# Altium project Temperature Sensor.PrjPcb (part 2 of 2)

## Sheet EEPROM and Temperature Sensor.SchDoc
size A4
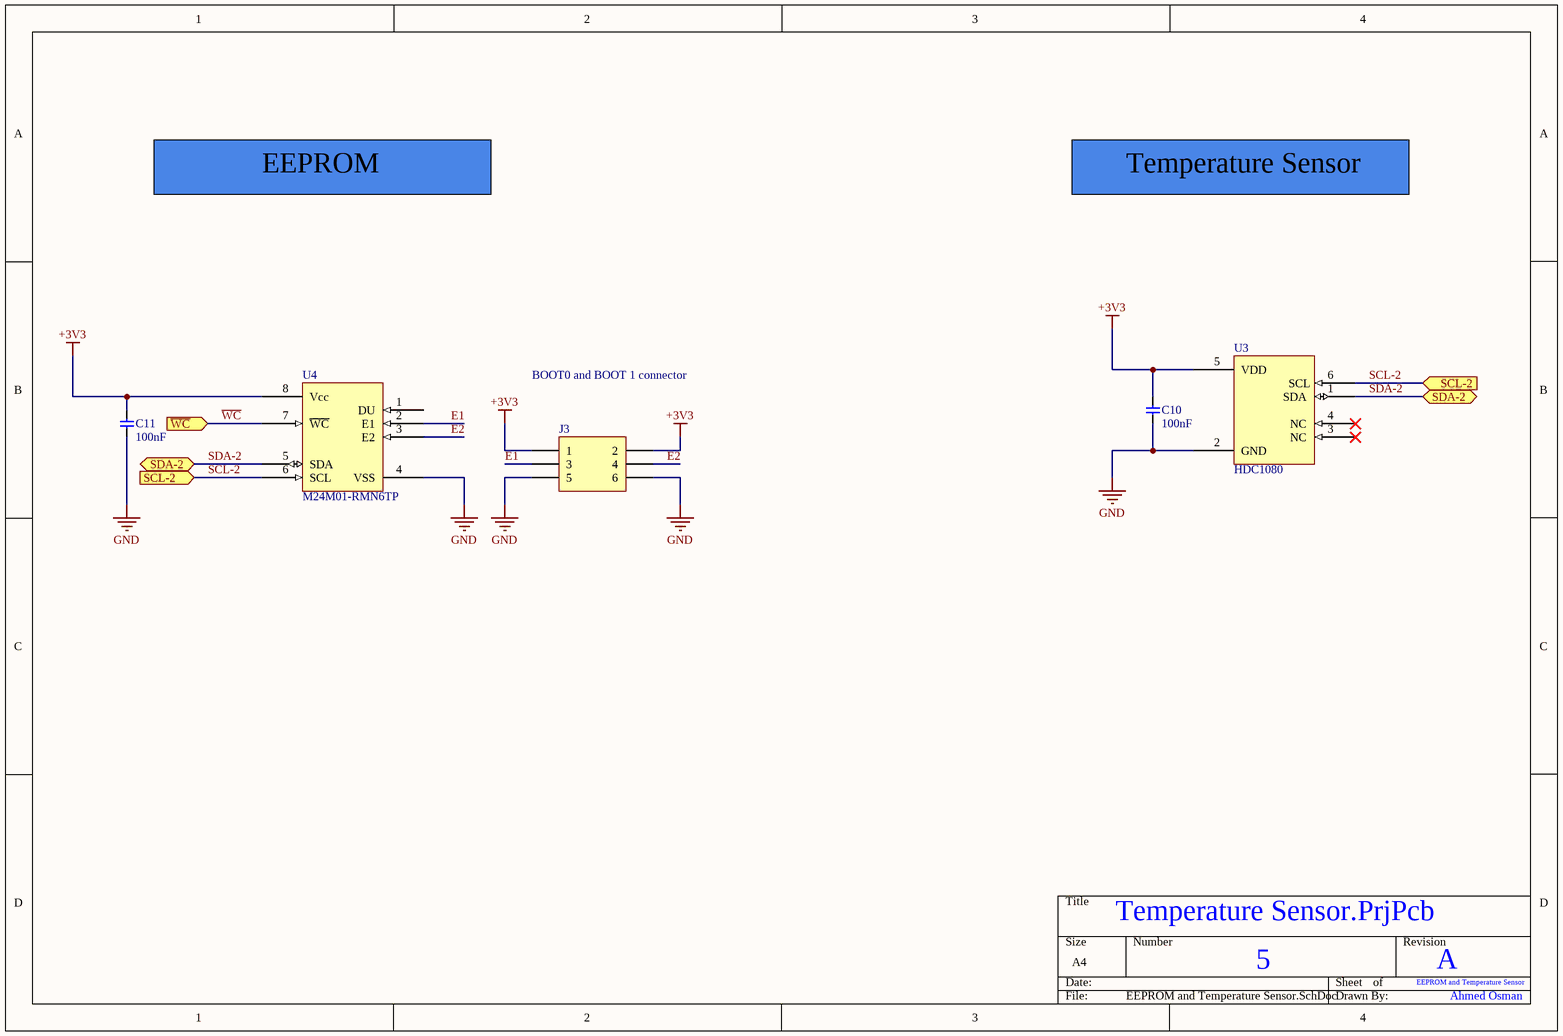
[diagram p4: EEPROM and Temperature Sensor.SchDoc]

### Parts
C10  100nF  [CAP 0603]
C11  100nF  [CAP 0603]
J3  BOOT0 and BOOT 1 connector  [2X3 Female Pin Header Connector]
U3  HDC1080  [PWSON(6-pin) DMB]
U4  M24M01-RMN6TP  [SO8N]

### Ports
SCL-2 (in), SDA-2 (bidir), ~{WC} (in)

### Nets
+3V3: C10.2 C11.1 J3.1 J3.2 U3.5(VDD) U4.8(Vcc)
GND: C10.1 C11.2 J3.5 J3.6 U3.2(GND) U4.4(VSS)
E1: J3.3 U4.2(E1)
E2: J3.4 U4.3(E2)
SCL-2: U3.6(SCL) U4.6(SCL) ; port SCL-2
SDA-2: U3.1(SDA) U4.5(SDA) ; port SDA-2
~{WC}: U4.7(~{WC}) ; port ~{WC}

Not connected (* = marked no-connect by the designer): U3 3(NC)* 4(NC)*; U4 1(DU)

### Notes on the sheet
- EEPROM
- Temperature Sensor
- 5
- EEPROM and Temperature Sensor
- A
- Ahmed Osman

### Library data of the parts
C10 C11 = CAP  0603 100nF 10% 50 V: 0.1 µF ±10% 50V Ceramic Capacitor X7R 0603 (1608 Metric); Manufacturer 1: Samsung; Manufacturer Part Number 1: CL10B104KB8NNNC; Supplier 1: Digikey; Stock 1: 6418947; Pricing 1: 4000 = 0.00562, 8000 = 0.00513, 12000 = 0.00489, 28000 = 0.00464, 100000 = 0.00336, 200000 = 0.00325, 400000 = 0.00306 (USD); RoHS: Yes; Mount: Surface Mount; Case/Package: 0603; Case Code (Metric): 1608; Case Code (Imperial): 0603; Material: Ceramic; Min Operating Temperature: -55°C; Max Operating Temperature: 125°C; Capacitance: 100nF; Tolerance: 10%; Dielectric: X7R; Voltage: 50V; Voltage Rating (DC): 50V; Voltage Rating: 50V; Package Quantity: 1; Packaging: Tape and Reel; Series: CL; Construction: Flat; Length: 1.6mm; Width: 0.031inch; Height: 0.8mm; Depth: 0.8mm; Thickness: 0.035inch; Radiation Hardening: No; Lead Free: Lead Free; RoHS Compliant: Yes; ComponentLink1URL: https://datasheet.ciiva.com/25803/cl10b104kb8nnnc-25803393.pdf?src-supplier=Digikey; ComponentLink1Description: https://datasheet.ciiva.com/25803/cl10b104kb8nnnc-25803393.pdf?src-supplier=Digikey; ComponentLink2URL: https://datasheet.ciiva.com/26838/getdatasheetpartid-89097-26838411.pdf?src-supplier=Verical; ComponentLink2Description: https://datasheet.ciiva.com/26838/getdatasheetpartid-89097-26838411.pdf?src-supplier=Verical; ComponentLink3URL: https://datasheet.ciiva.com/29198/456651-da-01-en-vs-kondensator-0605-29198839.pdf?src-supplier=Conrad; ComponentLink3Description: https://datasheet.ciiva.com/29198/456651-da-01-en-vs-kondensator-0605-29198839.pdf?src-supplier=Conrad; Supplier Part Number 1: 1276-1000-2-ND; value: 100nF; Manufacturer 2: Samsung; Manufacturer Part Number 2: CL10B104KB8NNNC; Supplier 2: LCSC; Supplier Part Number 2: C1591
J3 = BOOT0 and BOOT 1 connector: 2.54mm 2.54mm Double Row 2.5A 6P -40℃~+105℃ Direct Insert 2x3P Top 8.5mm Square Hole Plugin,P=2.54mm Female Headers ROHS; Supplier 2: LCSC; Supplier Part Number 2: C5116527; Manufacturer 2: ZHOURI; Manufacturer Part Number 2: PM2.54-2*3
U3 = HDC1080: Humidity, Temperature 0 ~ 100% RH I2C ±2% RH 15 s Surface Mount; Response Time: 15s; Supplier 1: Digikey; Stock 1: 6270; Pricing 1: 1 = 3.47, 5 = 2.928, 10 = 2.721, 25 = 2.4688, 50 = 2.2942, 100 = 2.1319, 500 = 1.79838, 1000 = 1.67143 (USD); RoHS: Yes; Mount: Surface Mount; Min Operating Temperature: -40°C; Max Operating Temperature: 125°C; Accuracy: 2%; Interface: I2C; Sensor Type: Temperature; Output Type: I2C; Series: -; Packaging: Cut Tape; Lead Free: Lead Free; RoHS Compliant: Yes; ComponentLink1URL: http://www.ti.com/lit/ds/symlink/hdc1080.pdf?src-supplier=Digikey; ComponentLink1Description: http://www.ti.com/lit/ds/symlink/hdc1080.pdf?src-supplier=Digikey; ComponentLink2URL: http://www.ti.com/general/docs/suppproductinfo.tsp?distId=10&amp;gotoUrl=http%3A%2F%2Fwww.ti.com%2Flit%2Fgpn%2Fhdc1080&src-supplier=Digikey; ComponentLink2Description: http://www.ti.com/general/docs/suppproductinfo.tsp?distId=10&amp;gotoUrl=http%3A%2F%2Fwww.ti.com%2Flit%2Fgpn%2Fhdc1080&src-supplier=Digikey; Supplier 2: LCSC; Supplier Part Number 2: C82227; Supplier Part Number 1: 296-46272-1-ND; Manufacturer 2: Texas Instruments; Manufacturer Part Number 2: HDC1080DMBR
U4 = M24M01-RMN6TP: EEPROM Memory IC 1Mbit I2C 1 MHz 500 ns 8-SOIC; Organization: 32KX8; Interface: I2C,Serial; Access Time: 500ns; Density: 1Mb; Max Frequency: 400kHz; Max Supply Voltage: 5.5V; Min Supply Voltage: 1.8V; Frequency: 1MHz; Operating Supply Voltage: 5V; Memory Type: Non-Volatile,EEPROM; Write Cycle Time-Max (tWC): 5ms; Access Time-Max: 900ns; Write Protection: YES; Supply Current: 2mA; Supplier 1: Digikey; Stock 1: 11953; Pricing 1: 1 = 1.41, 10 = 1.287, 25 = 1.252, 50 = 1.2456, 100 = 1.1134, 250 = 1.11012, 500 = 1.09336, 1000 = 1.04695 (USD); RoHS: Yes; Mount: Surface Mount; Case/Package: SOIC; Number of Pins: 8; Min Operating Temperature: -40°C; Max Operating Temperature: 85°C; Packaging: Tape and Reel; Package Quantity: 2500; Memory Size: 1Mb; Series: -; Supply Voltage-Nom: 5.5V; Programming Voltage: 5.5V; Length: 5mm; Width: 4mm; Height: 1.25mm; Radiation Hardening: No; Lead Free: Lead Free; RoHS Compliant: Yes; ComponentLink1URL: https://datasheet.ciiva.com/1905/cd00147128-1905279.pdf?src-supplier=Digikey; ComponentLink1Description: https://datasheet.ciiva.com/1905/cd00147128-1905279.pdf?src-supplier=Digikey; ComponentLink2URL: https://datasheet.ciiva.com/1905/cd00147128-1905280.pdf?src-supplier=Digikey; ComponentLink2Description: https://datasheet.ciiva.com/1905/cd00147128-1905280.pdf?src-supplier=Digikey; ComponentLink3URL: https://datasheet.ciiva.com/1905/cd00147128-1905281.pdf?src-supplier=Digikey; ComponentLink3Description: https://datasheet.ciiva.com/1905/cd00147128-1905281.pdf?src-supplier=Digikey; ComponentLink4URL: https://datasheet.ciiva.com/41455/001185587-da-01-en-ic-eeprom-1mbit-m24m01-rmn6tp-soic-8-stm-41455205.pdf?src-supplier=Conrad; ComponentLink4Description: https://datasheet.ciiva.com/41455/001185587-da-01-en-ic-eeprom-1mbit-m24m01-rmn6tp-soic-8-stm-41455205.pdf?src-supplier=Conrad; Supplier 2: LCSC; Supplier Part Number 2: C79990; Supplier Part Number 1: 497-6351-1-ND; Manufacturer 2: STMicroelectronics; Manufacturer Part Number 2: M24M01-RMN6TP

## Sheet Bluetooth and OLED Display.SchDoc
size A4
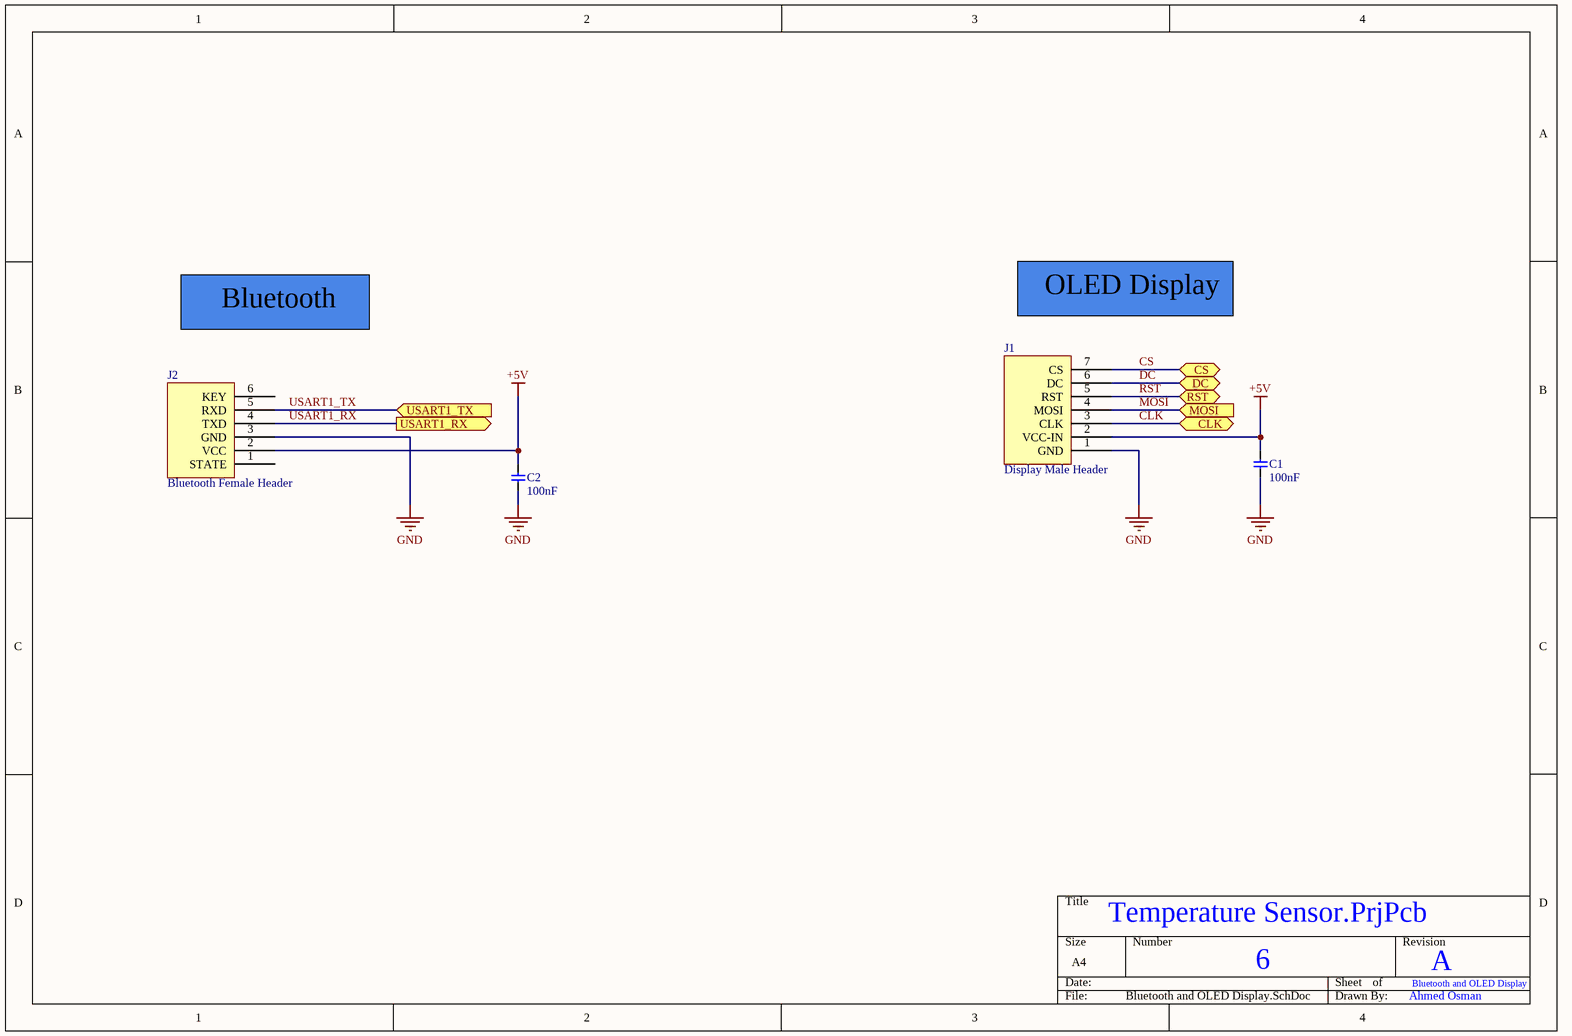
[diagram p5: Bluetooth and OLED Display.SchDoc]

### Parts
C1  100nF  [CAP 0603]
C2  100nF  [CAP 0603]
J1  Display Male Header  [OLED Display]
J2  Bluetooth Female Header  [HC-05 Bluetooth]

### Ports
CLK (bidir), CS (bidir), DC (bidir), MOSI (in), RST (bidir), USART1_RX (out), USART1_TX (in)

### Nets
+5V: C1.2 C2.1 J1.2(VCC-IN) J2.2(VCC)
GND: C1.1 C2.2 J1.1(GND) J2.3(GND)
CLK: J1.3(CLK) ; port CLK
CS: J1.7(CS) ; port CS
DC: J1.6(DC) ; port DC
MOSI: J1.4(MOSI) ; port MOSI
RST: J1.5(RST) ; port RST
USART1_RX: J2.4(TXD) ; port USART1_RX
USART1_TX: J2.5(RXD) ; port USART1_TX

Not connected (* = marked no-connect by the designer): J2 1(STATE) 6(KEY)

### Notes on the sheet
- Bluetooth
- OLED Display
- 6
- Bluetooth and OLED Display
- A
- Ahmed Osman

### Library data of the parts
C1 C2 = CAP  0603 100 nF 10% 50 V: 0.1 µF ±10% 50V Ceramic Capacitor X7R 0603 (1608 Metric); Manufacturer 1: Samsung; Manufacturer Part Number 1: CL10B104KB8NNNC; Supplier 1: Digikey; Stock 1: 6418947; Pricing 1: 4000 = 0.00562, 8000 = 0.00513, 12000 = 0.00489, 28000 = 0.00464, 100000 = 0.00336, 200000 = 0.00325, 400000 = 0.00306 (USD); RoHS: Yes; Mount: Surface Mount; Case/Package: 0603; Case Code (Metric): 1608; Case Code (Imperial): 0603; Material: Ceramic; Min Operating Temperature: -55°C; Max Operating Temperature: 125°C; Capacitance: 100nF; Tolerance: 10%; Dielectric: X7R; Voltage: 50V; Voltage Rating (DC): 50V; Voltage Rating: 50V; Package Quantity: 1; Packaging: Tape and Reel; Series: CL; Construction: Flat; Length: 1.6mm; Width: 0.031inch; Height: 0.8mm; Depth: 0.8mm; Thickness: 0.035inch; Radiation Hardening: No; Lead Free: Lead Free; RoHS Compliant: Yes; ComponentLink1URL: https://datasheet.ciiva.com/25803/cl10b104kb8nnnc-25803393.pdf?src-supplier=Digikey; ComponentLink1Description: https://datasheet.ciiva.com/25803/cl10b104kb8nnnc-25803393.pdf?src-supplier=Digikey; ComponentLink2URL: https://datasheet.ciiva.com/26838/getdatasheetpartid-89097-26838411.pdf?src-supplier=Verical; ComponentLink2Description: https://datasheet.ciiva.com/26838/getdatasheetpartid-89097-26838411.pdf?src-supplier=Verical; ComponentLink3URL: https://datasheet.ciiva.com/29198/456651-da-01-en-vs-kondensator-0605-29198839.pdf?src-supplier=Conrad; ComponentLink3Description: https://datasheet.ciiva.com/29198/456651-da-01-en-vs-kondensator-0605-29198839.pdf?src-supplier=Conrad; Supplier Part Number 1: 1276-1000-2-ND; value: 100nF; Manufacturer 2: Samsung; Manufacturer Part Number 2: CL10B104KB8NNNC; Supplier 2: LCSC; Supplier Part Number 2: C1591
J1 = Display connector: - Display: 0.95" Inch 7 Pin Colorful 65K SPI OLED Display Module SSD1331 9664 Resolution For 51 STM32 Arduino / - Connector: Direct Insert Policy 2.5mm 7P 6mm -40℃~+105℃ 3mm 2.54mm Single Row Black Brass 1x7P Plugin,P=2.54mm Pin Headers ROHS; Supplier 2: LCSC; Supplier Part Number 2: C492406; Manufacturer 2: XFCN; Manufacturer Part Number 2: PZ254V-11-07P
J2 = HC-05 Bluetooth Connector: Number of Positions: 6; Voltage Rating: 250V; Current Rating: 3A; Number of Contacts: 6NUMBER; Supplier 1: Digikey; Stock 1: 9721; Pricing 1: 1 = 0.47, 10 = 0.382, 80 = 0.31725, 440 = 0.27275, 1000 = 0.25359, 5000 = 0.2405 (USD); RoHS: Yes; Mount: Through Hole; Contact Material: Nickel,Gold; Housing Material: Plastic; Contact Finish - Mating: GOLD; Insulation Color: Black; Insulation Material: Polyester; Contact Shape: Square; Min Operating Temperature: -40°C; Max Operating Temperature: 105°C; Number of Rows: 1; Packaging: Tray; Termination: Solder; Connector Type: Header; Contact Type: Female Socket; Fastening Type: Pull; Series: -; Length: 15.7mm; Width: 2.5mm; Height: 8.7mm; Lead Free: Lead Free; RoHS Compliant: Yes; Flammability Rating: UL94 V-0; ComponentLink1URL: https://media.digikey.com/pdf/Data%20Sheets/Sullins%20PDFs/Female_Headers.100_DS.pdf?src-supplier=Digikey; ComponentLink1Description: https://media.digikey.com/pdf/Data%20Sheets/Sullins%20PDFs/Female_Headers.100_DS.pdf?src-supplier=Digikey; Supplier Part Number 1: S7039-ND; Manufacturer 2: Sullins; Manufacturer Part Number 2: PPPC061LFBN-RC; Supplier 2: LCSC; Supplier Part Number 2: C5845309

## Nets that join several sheets
+3V3: Buck Converter and LDO (C9.2 D7.2 U2.2), MCU_ (21 pins), EEPROM and Temperature Sensor (6 pins)
+5V: Buck Converter and LDO (7 pins), MCU_ (J6.8 J9.1 U6.5), Bluetooth and OLED Display (C1.2 C2.1 J1.2 J2.2)
GND: Buck Converter and LDO (15 pins), MCU_ (46 pins), EEPROM and Temperature Sensor (6 pins), Bluetooth and OLED Display (C1.1 C2.2 J1.1 J2.3)
CLK: MCU_ (U5.26), Bluetooth and OLED Display (J1.3)
CS: MCU_ (U5.45), Bluetooth and OLED Display (J1.7)
DC: MCU_ (U5.43), Bluetooth and OLED Display (J1.6)
MOSI: MCU_ (U5.28), Bluetooth and OLED Display (J1.4)
RST: MCU_ (U5.42), Bluetooth and OLED Display (J1.5)
SCL-2: MCU_ (R6.1 U5.21), EEPROM and Temperature Sensor (U3.6 U4.6)
SDA-2: MCU_ (R5.1 U5.22), EEPROM and Temperature Sensor (U3.1 U4.5)
USART1_RX: MCU_ (R7.1 U5.31), Bluetooth and OLED Display (J2.4)
USART1_TX: MCU_ (R8.1 U5.30), Bluetooth and OLED Display (J2.5)
~{WC}: MCU_ (U5.46), EEPROM and Temperature Sensor (U4.7)